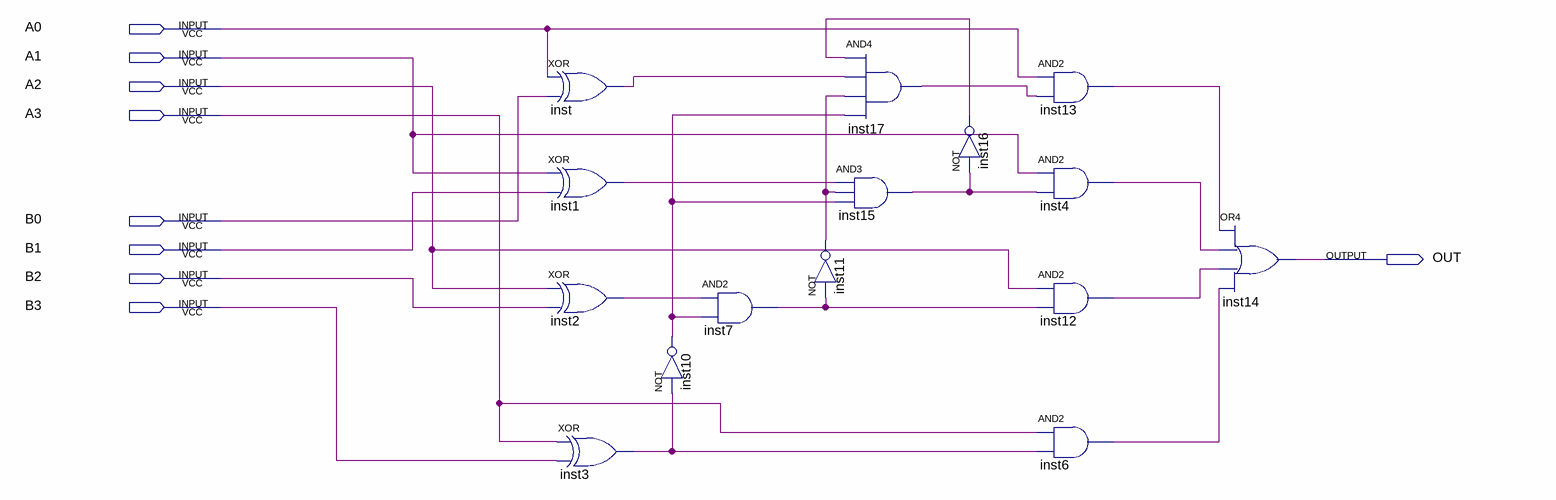
[diagram p0: schematic sheet]
// Quartus schematic AMaiorB.bdf as structural Verilog: 15 symbols, 9 pins
module AMaiorB (
  input  A0,
  input  A1,
  input  A2,
  input  A3,
  input  B0,
  input  B1,
  input  B2,
  input  B3,
  output OUT
);

  wire inst1_out, inst2_out, inst3_out, inst4_out, inst6_out, inst7_out, inst10_out, inst11_out, inst12_out,
       inst13_out, inst15_out, inst16_out, inst17_out, inst_out;

  xor inst (inst_out, A0, B0);
  xor inst1 (inst1_out, A1, B1);
  xor inst2 (inst2_out, A2, B2);
  xor inst3 (inst3_out, A3, B3);
  and inst7 (inst7_out, inst2_out, inst10_out);
  not inst10 (inst10_out, inst3_out);
  and inst17 (inst17_out, inst16_out, inst_out, inst11_out, inst10_out);
  and inst15 (inst15_out, inst1_out, inst11_out, inst10_out);
  not inst11 (inst11_out, inst7_out);
  not inst16 (inst16_out, inst15_out);
  and inst13 (inst13_out, A0, inst17_out);
  and inst4 (inst4_out, A1, inst15_out);
  and inst12 (inst12_out, A2, inst7_out);
  and inst6 (inst6_out, A3, inst3_out);
  or inst14 (OUT, inst13_out, inst4_out, inst12_out, inst6_out);
endmodule
